# Altium schematic sheet Sheet.SchDoc
size A4; SheetNumber: 1; SheetTotal: 1
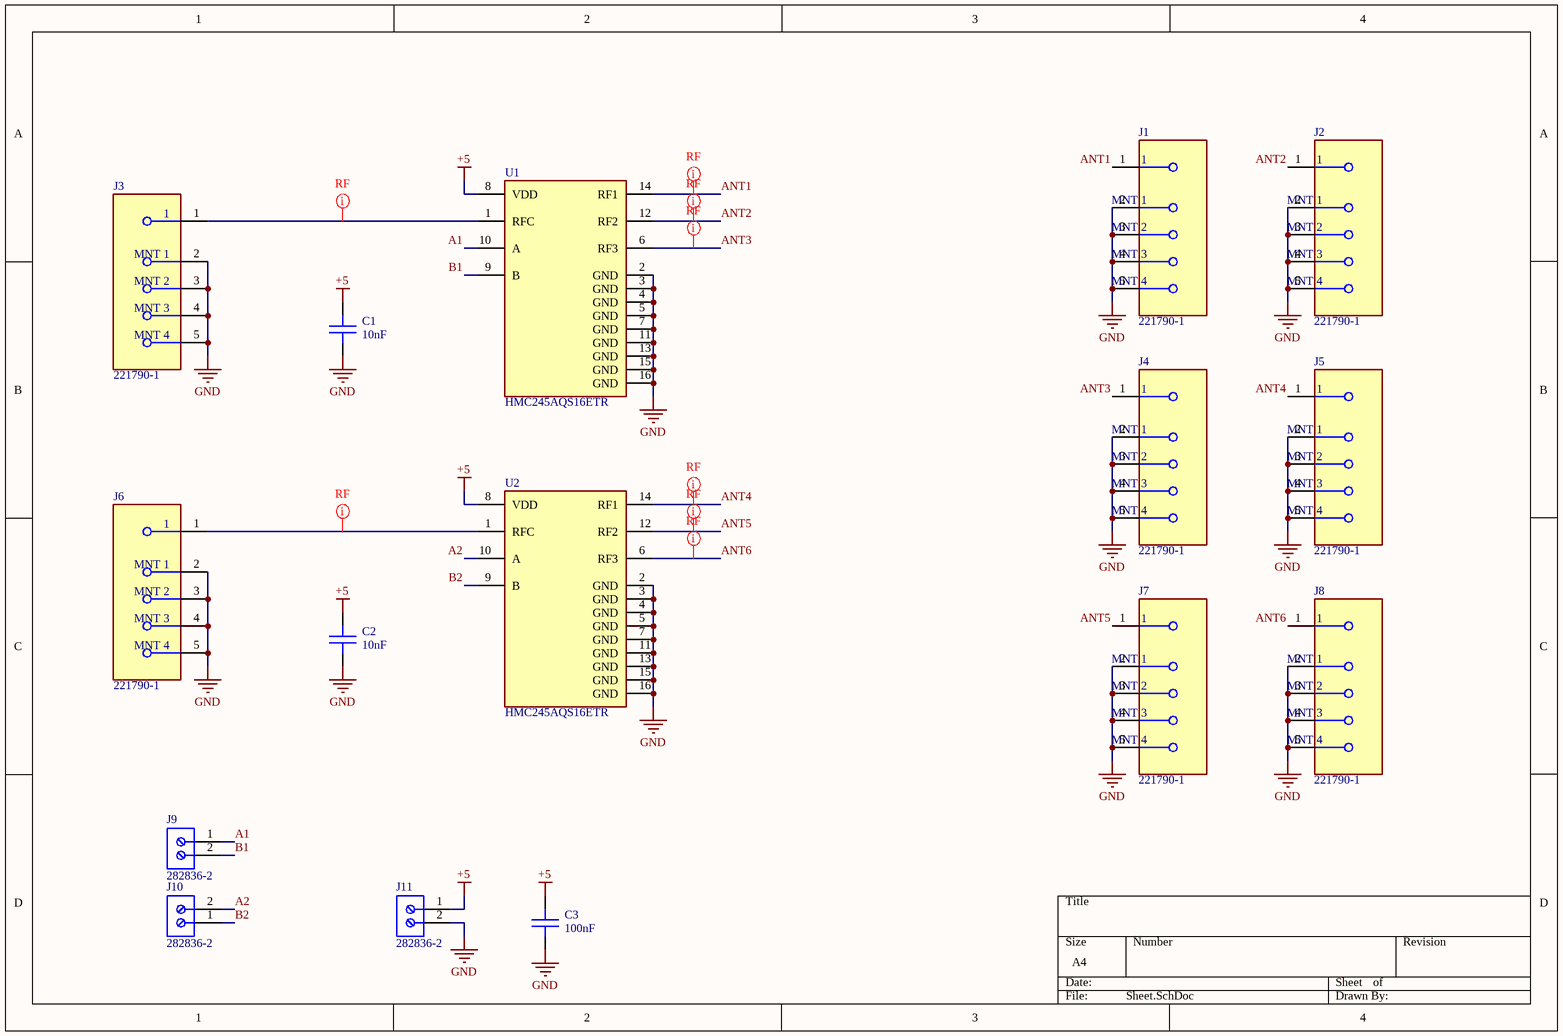
[diagram p0: Sheet.SchDoc]

## Parts
C1  value 10nF  [C0603 (1608)]  (hidden comment: Cap SMD)
C2  value 10nF  [C0603 (1608)]  (hidden comment: Cap SMD)
C3  value 100nF  [C0603 (1608)]  (hidden comment: Cap SMD)
J1  221790-1  [FP-221790-1-MFG]
J2  221790-1  [FP-221790-1-MFG]
J3  221790-1  [FP-221790-1-MFG]
J4  221790-1  [FP-221790-1-MFG]
J5  221790-1  [FP-221790-1-MFG]
J6  221790-1  [FP-221790-1-MFG]
J7  221790-1  [FP-221790-1-MFG]
J8  221790-1  [FP-221790-1-MFG]
J9  282836-2  [TECO-282836-2_V]
J10  282836-2  [TECO-282836-2_V]
J11  282836-2  [TECO-282836-2_V]
U1  HMC245AQS16ETR  [FP-RQ-16-IPC_C]
U2  HMC245AQS16ETR  [FP-RQ-16-IPC_C]

## Nets
+5: C1.2 C2.2 C3.2 J11.1 U1.8(VDD) U2.8(VDD)
GND: C1.1 C2.1 C3.1 J1.2(MNT_1) J1.3(MNT_2) J1.4(MNT_3) J1.5(MNT_4) J2.2(MNT_1) J2.3(MNT_2) J2.4(MNT_3) J2.5(MNT_4) J3.2(MNT_1) J3.3(MNT_2) J3.4(MNT_3) J3.5(MNT_4) J4.2(MNT_1) J4.3(MNT_2) J4.4(MNT_3) J4.5(MNT_4) J5.2(MNT_1) J5.3(MNT_2) J5.4(MNT_3) J5.5(MNT_4) J6.2(MNT_1) J6.3(MNT_2) J6.4(MNT_3) J6.5(MNT_4) J7.2(MNT_1) J7.3(MNT_2) J7.4(MNT_3) J7.5(MNT_4) J8.2(MNT_1) J8.3(MNT_2) J8.4(MNT_3) J8.5(MNT_4) J11.2 U1.2(GND) U1.3(GND) U1.4(GND) U1.5(GND) U1.7(GND) U1.11(GND) U1.13(GND) U1.15(GND) U1.16(GND) U2.2(GND) U2.3(GND) U2.4(GND) U2.5(GND) U2.7(GND) U2.11(GND) U2.13(GND) U2.15(GND) U2.16(GND)
A1: J9.1 U1.10(A)
A2: J10.2 U2.10(A)
ANT1: J1.1 U1.14(RF1)
ANT2: J2.1 U1.12(RF2)
ANT3: J4.1 U1.6(RF3)
ANT4: J5.1 U2.14(RF1)
ANT5: J7.1 U2.12(RF2)
ANT6: J8.1 U2.6(RF3)
B1: J9.2 U1.9(B)
B2: J10.1 U2.9(B)
NetJ3_1: J3.1 U1.1(RFC)
NetJ6_1: J6.1 U2.1(RFC)

## Layout directives
net class RF; net class OUT: ANT1, ANT2, ANT3, ANT4, ANT5, ANT6
net class RF; net class IN: NetJ3_1, NetJ6_1

## Library data of the parts
J1-J8 = CMP-05166-000001-1: CONN SMA JACK R/A 50 OHM PCB; Manufacturer: TE Connectivity / AMP; Is Female: yes; Impedance: 50Ω; Number Of Contacts: 1; Shielding: true; Voltage Rating: 335V; Frequency: 4GHz; Dielectric Material: Fluoropolymer; Conn Orientation: Right Angle; Octopart: https://octopart.com/2217901-te+connectivity+%2F+amp-3339836; Contact Material: Gold; Temperature: -65°C to +165°C; RoHS: TRUE; Device Class L1: Connectors; Temperature Range Low: -65°C; Mouser Description: RF Connectors / Coaxial Connectors PCB RIGHT ANGLE JACK; Lead Free: Yes; Manufacturer Part Number: 221790-1; Device Class L3: unset; Temperature Range High: +165°C; ComponentLink2URL: https://www.te.com/commerce/DocumentDelivery/DDEController?Action=showdoc&DocId=Customer+Drawing%7F221790%7FB1%7Fpdf%7FEnglish%7FENG_CD_221790_B1.pdf%7F221790-1; Package: 0; ComponentLink2Description: Datasheet; Digikey Description: CONN SMA JACK R/A 50 OHM PCB; Device Class L2: RF / Coaxial Connectors; Category: Conn; Height: 0.38inch; Automotive: No
J9-J11 = CMP-1684-00017-1: Female Header, Pitch 5 mm, 1 x 2 Position, Height 10 mm, Tail Length 3.5 mm, Rohs, Bulk; Manufacturer: TE Connectivity; Wire Gauge: 16-30AWG; Product Training Modules: Wire-to-BoardEurostyleTerminalBlocks; Clamp Material - Plating: Brass-NickelPlated; Voltage: 300V; Mating Orientation: HorizontalwithBoard; Current: 13.5A; Pitch: 0.197"(5.00mm); Screw Thread: M3; 3D Model: 282836-2.pdf; Other Names: 5ULV-02B / A98076; Dynamic Catalog: BuchananSeries; Number of Levels: 1; Torque - Screw: 0.68Nm(6Lb-In); Featured Product: EurostyleTerminalBlockConnectors; Positions Per Level: 2; Wire Termination: Screw-RisingCageClamp; Datasheet URL: http://www.te.com.cn/commerce/DocumentDelivery/DDEController?Action=showdoc&DocId=Catalog+Section%7F1308389_EUROSTYLE_TERMINAL_BLOCKS%7F0607%7Fpdf%7FEnglish%7FENG_CS_1308389_EUROSTYLE_TERMINAL_BLOCKS_0607.pdf%7F282836-2; Color: Green; Family: TerminalBlocks-WiretoBoard; RoHS Information: 282836-2StatementofCompliance; Standard Package: 300; Contact Material - Plating: Brass-TinPlated; Manufacturer URL: http://www.te.com; Housing Material: Polyamide(PA66),Nylon6/6; Features: Interlocking(Side); Package Description: Female Header, Pitch 5 mm, 1 x 2 Position, Height 10 mm, Tail Length 3.5 mm; Mounting Type: ThroughHole; Package Reference: THD; Packaging: Bulk; Series: Buchanan; Category: Connectors,Interconnects; Screw Material - Plating: Brass-NickelPlated
U1 U2 = CMP-09141-000176-1: IC RF SWITCH SP3T 3.5GHZ 16QSOP; IIP3: 48dBm; Impedance: 50R; Throw Configuration: SP4T; Max Supply Voltage: 5.5V; Min Supply Voltage: 4.5V; P1dB: 29dBm; Min Operating Temperature: -40°C; REACH SVHC: No SVHC; Max Operating Temperature: 85°C; Case/Package: QSOP; Packaging: Cut Tape; Max Frequency: 3.5GHz; Number of Pins: 16; Lead Free: Contains Lead